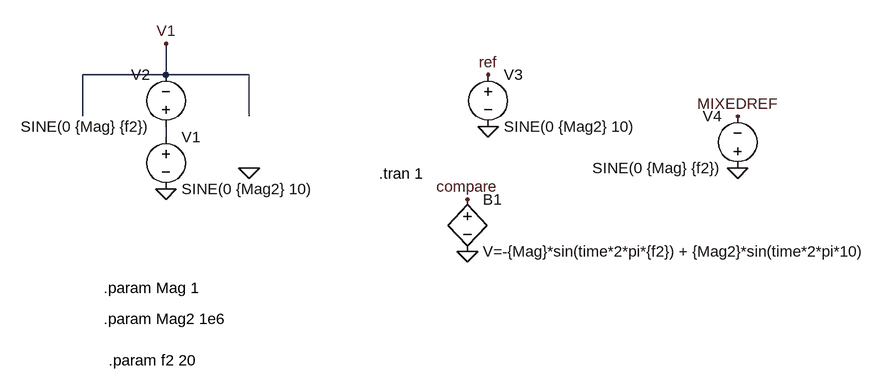
[diagram p0: schematic test.asc]
test.asc, the LTspice schematic file:
Version 4
SHEET 1 1504 744
WIRE 384 288 384 240
WIRE 384 288 256 288
WIRE 512 288 384 288
WIRE 256 352 256 288
WIRE 512 352 512 288
WIRE 384 384 384 368
FLAG 512 432 0
FLAG 384 464 0
FLAG 384 240 V1
FLAG 880 368 0
FLAG 880 288 ref
FLAG 848 560 0
FLAG 848 480 compare
FLAG 1264 432 0
FLAG 1264 352 MIXEDREF
SYMBOL Voltage 384 368 R0
SYMATTR InstName V1
SYMATTR Value SINE(0 {Mag2} 10)
SYMBOL Voltage 384 384 R180
WINDOW 0 24 96 Left 2
WINDOW 3 24 16 Left 2
SYMATTR InstName V2
SYMATTR Value SINE(0 {Mag} {f2})
SYMBOL Voltage 880 272 R0
SYMATTR InstName V3
SYMATTR Value SINE(0 {Mag2} 10)
SYMBOL bv 848 464 R0
SYMATTR InstName B1
SYMATTR Value V=-{Mag}*sin(time*2*pi*{f2}) + {Mag2}*sin(time*2*pi*10)
SYMBOL Voltage 1264 448 R180
WINDOW 0 24 96 Left 2
WINDOW 3 24 16 Left 2
SYMATTR InstName V4
SYMATTR Value SINE(0 {Mag} {f2})
TEXT 712 440 Left 2 !.tran 1
TEXT 288 616 Left 2 !.param Mag 1
TEXT 288 664 Left 2 !.param Mag2 1e6
TEXT 296 728 Left 2 !.param f2 20

The netlist it stands for:
* test.asc
V1 N001 0 SINE(0 {Mag2} 10)
V2 N001 V1 SINE(0 {Mag} {f2})
V3 ref 0 SINE(0 {Mag2} 10)
B1 compare 0 V=-{Mag}*sin(time*2*pi*{f2}) + {Mag2}*sin(time*2*pi*10)
V4 0 MIXEDREF SINE(0 {Mag} {f2})
.tran 1
.param Mag 1
.param Mag2 1e6
.param f2 20
.backanno
.end